# EAGLE schematic chip_counter (EAGLE 9.6.2)
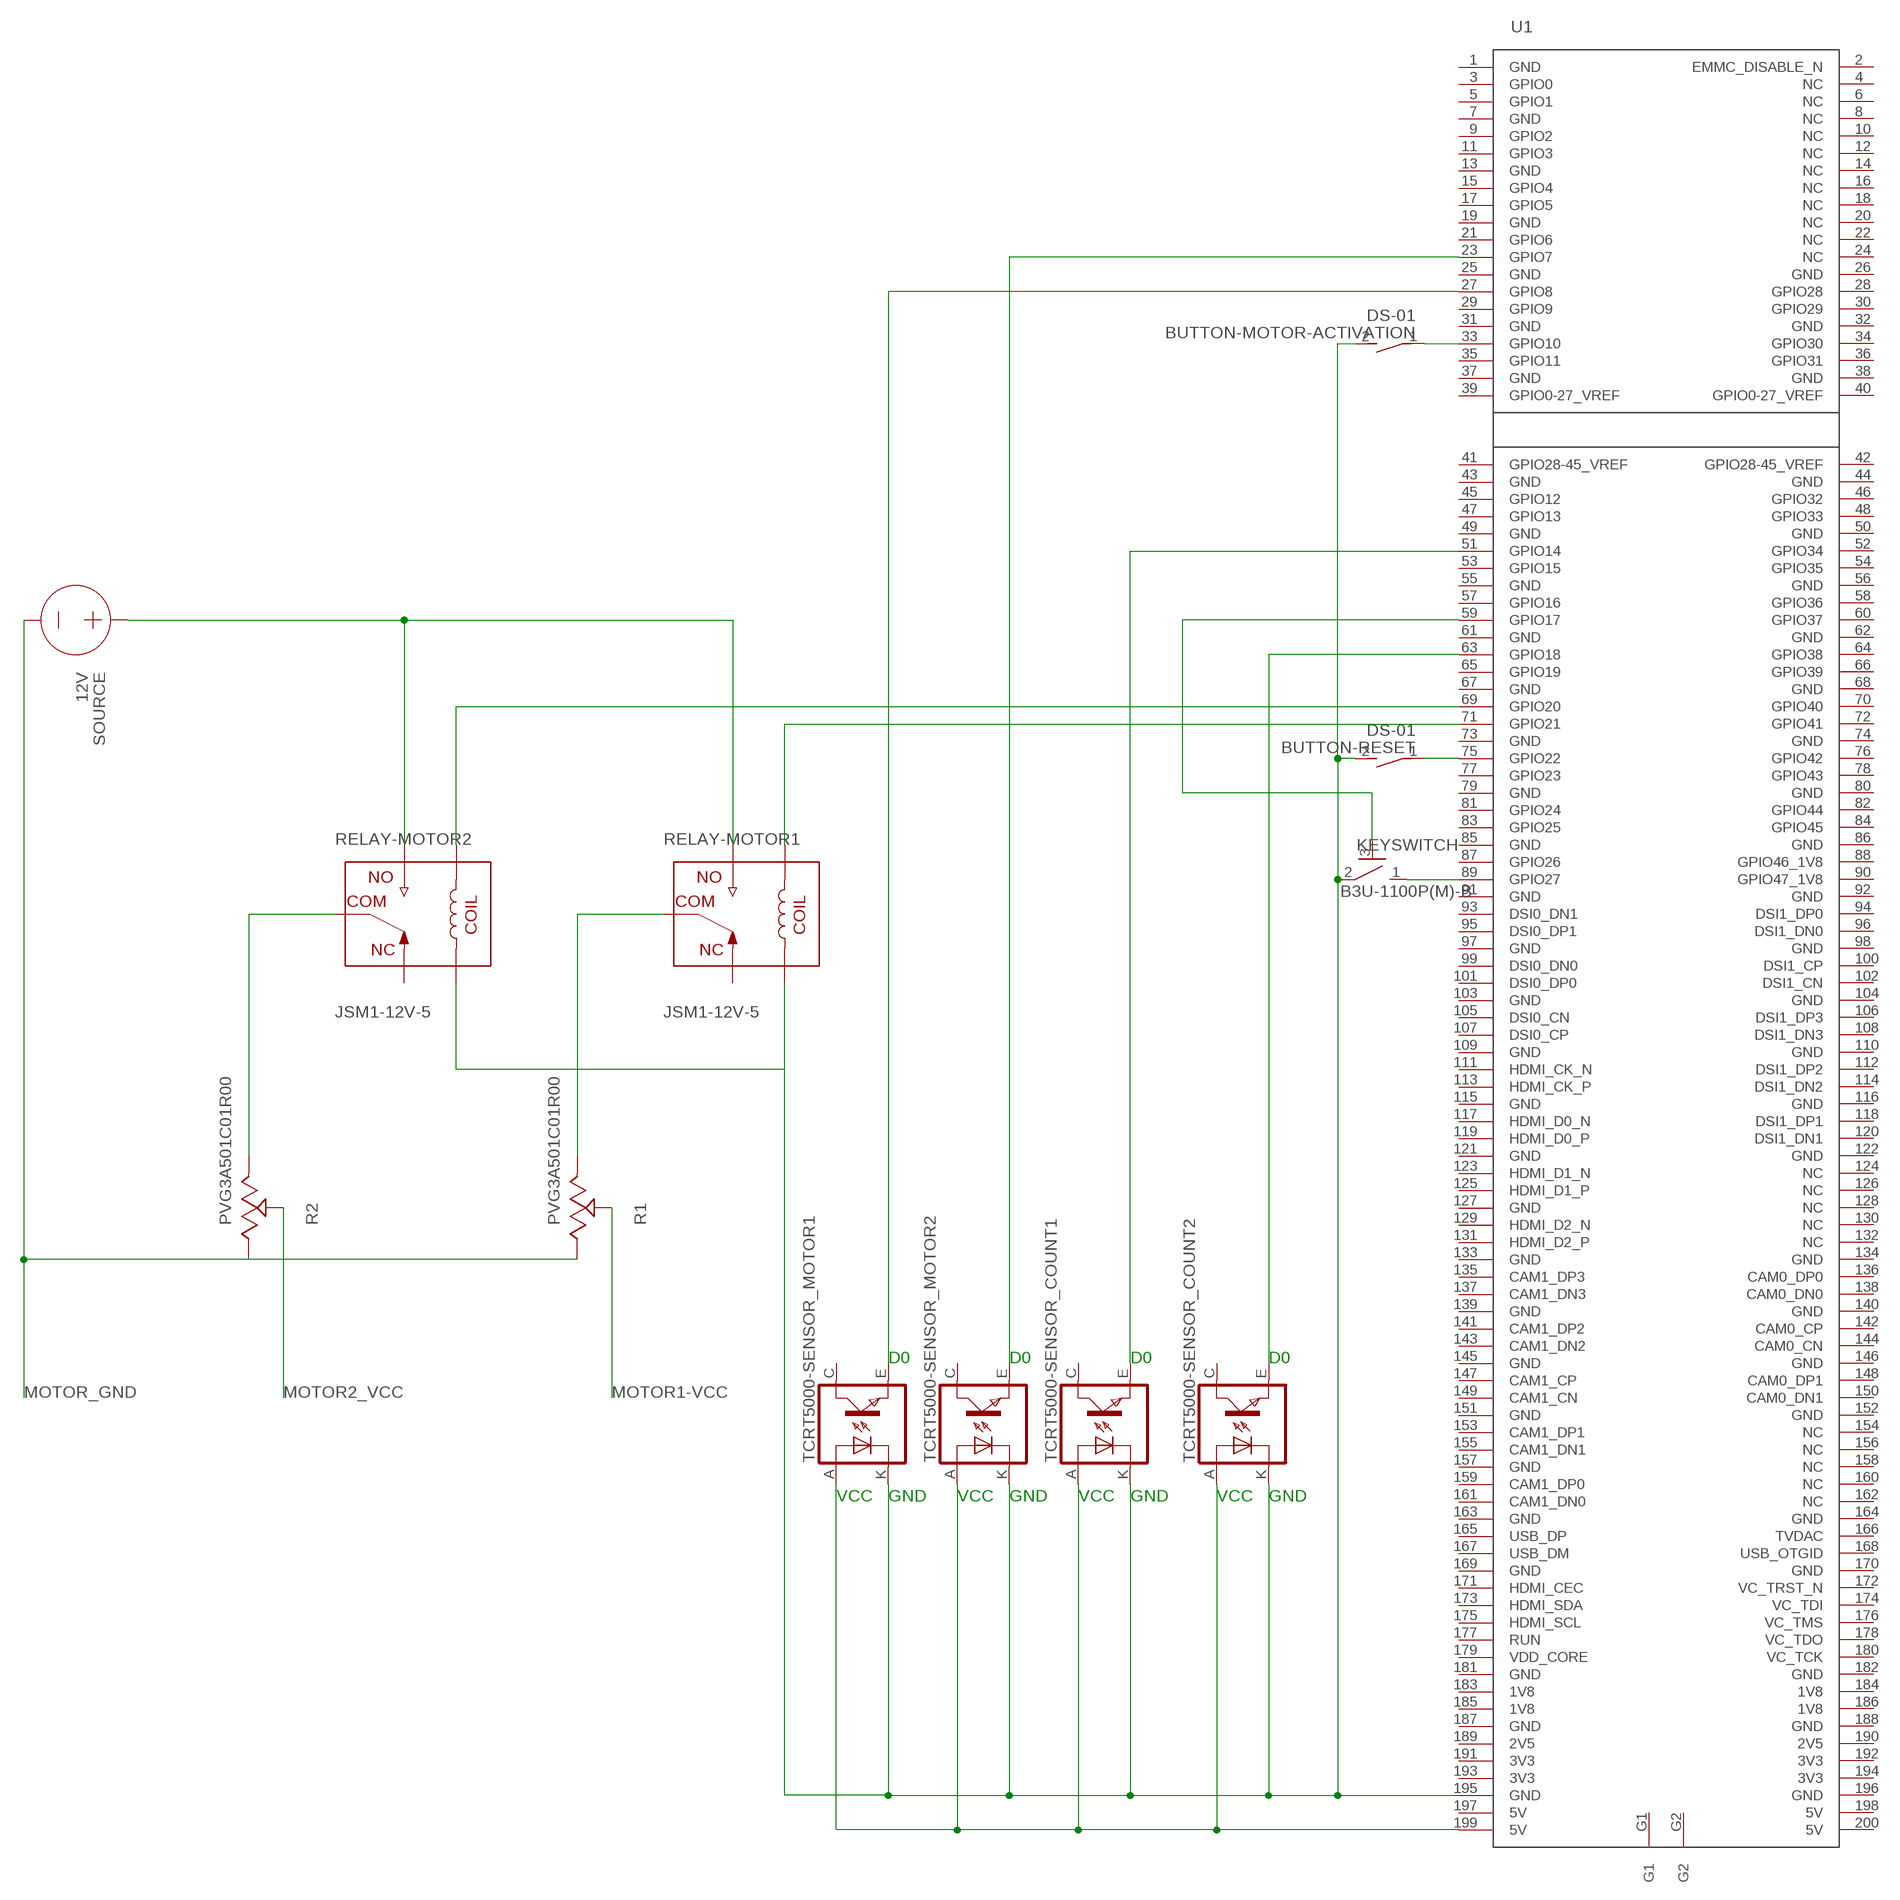
[diagram p0: schematic, sheet 1]

## Parts
BUTTON-MOTOR-ACTIVATION  DS-01  DS01E  [DS-01]
BUTTON-RESET  DS-01  DS01E  [DS-01]
KEYSWITCH  B3U-1100P(M)-B  B3U-X100B3U-1100P(M)-B1100P(M)-B  [B3U-1100P(M)-B]
R1  PVG3A501C01R00  [PVG3A501C01R00]
R2  PVG3A501C01R00  [PVG3A501C01R00]
RELAY-MOTOR1  JSM1-12V-5  [JSM1-12V-5]
RELAY-MOTOR2  JSM1-12V-5  [JSM1-12V-5]
SOURCE  12V  VOLTAGE  (no package)
TCRT5000-SENSOR_COUNT1  TCRT5000  [TCRT5000]
TCRT5000-SENSOR_COUNT2  TCRT5000  [TCRT5000]
TCRT5000-SENSOR_MOTOR1  TCRT5000  [TCRT5000]
TCRT5000-SENSOR_MOTOR2  TCRT5000  [TCRT5000]
U1  COMPUTE_MODULE  [SO-DIMM]

## Nets
MOTOR1-VCC: R1.2
MOTOR2_VCC: R2.2
MOTOR_GND: R1.3 R2.3 SOURCE.-
N$1: TCRT5000-SENSOR_COUNT1.A(ANODE) TCRT5000-SENSOR_COUNT2.A(ANODE) TCRT5000-SENSOR_MOTOR1.A(ANODE) TCRT5000-SENSOR_MOTOR2.A(ANODE) U1.199(5V)
N$3: TCRT5000-SENSOR_COUNT1.E(EMITTER) U1.51(GPIO14)
N$4: TCRT5000-SENSOR_COUNT2.E(EMITTER) U1.63(GPIO18)
N$5: TCRT5000-SENSOR_MOTOR1.E(EMITTER) U1.27(GPIO8)
N$6: TCRT5000-SENSOR_MOTOR2.E(EMITTER) U1.23(GPIO7)
N$7: BUTTON-MOTOR-ACTIVATION.2 BUTTON-RESET.2 KEYSWITCH.2 RELAY-MOTOR1.5 RELAY-MOTOR2.5 TCRT5000-SENSOR_COUNT1.K(CATHODE) TCRT5000-SENSOR_COUNT2.K(CATHODE) TCRT5000-SENSOR_MOTOR1.K(CATHODE) TCRT5000-SENSOR_MOTOR2.K(CATHODE) U1.195(GND)
N$8: BUTTON-RESET.1 U1.75(GPIO22)
N$9: BUTTON-MOTOR-ACTIVATION.1 U1.33(GPIO10)
N$10: KEYSWITCH.3 U1.59(GPIO17)
N$11: KEYSWITCH.1 U1.89(GPIO27)
N$12: RELAY-MOTOR1.2 U1.71(GPIO21)
N$13: RELAY-MOTOR2.2 U1.69(GPIO20)
N$16: RELAY-MOTOR1.3 RELAY-MOTOR2.3 SOURCE.+
N$18: R2.1 RELAY-MOTOR2.1
N$19: R1.1 RELAY-MOTOR1.1
Unconnected: RELAY-MOTOR1.4 RELAY-MOTOR2.4 TCRT5000-SENSOR_COUNT1.C(COLLECTOR) TCRT5000-SENSOR_COUNT2.C(COLLECTOR) TCRT5000-SENSOR_MOTOR1.C(COLLECTOR) TCRT5000-SENSOR_MOTOR2.C(COLLECTOR) U1.1(GND) U1.2(EMMC_DISABLE_N) U1.3(GPIO0) U1.4(NC) U1.5(GPIO1) U1.6(NC) U1.7(GND) U1.8(NC) U1.9(GPIO2) U1.10(NC) U1.11(GPIO3) U1.12(NC) U1.13(GND) U1.14(NC) U1.15(GPIO4) U1.16(NC) U1.17(GPIO5) U1.18(NC) U1.19(GND) U1.20(NC) U1.21(GPIO6) U1.22(NC) U1.24(NC) U1.25(GND) U1.26(GND) U1.28(GPIO28) U1.29(GPIO9) U1.30(GPIO29) U1.31(GND) U1.32(GND) U1.34(GPIO30) U1.35(GPIO11) U1.36(GPIO31) U1.37(GND) U1.38(GND) U1.39(GPIO0-27_VREF) U1.40(GPIO0-27_VREF) U1.41(GPIO28-45_VREF) U1.42(GPIO28-45_VREF) U1.43(GND) U1.44(GND) U1.45(GPIO12) U1.46(GPIO32) U1.47(GPIO13) U1.48(GPIO33) U1.49(GND) U1.50(GND) U1.52(GPIO34) U1.53(GPIO15) U1.54(GPIO35) U1.55(GND) U1.56(GND) U1.57(GPIO16) U1.58(GPIO36) U1.60(GPIO37) U1.61(GND) U1.62(GND) U1.64(GPIO38) U1.65(GPIO19) U1.66(GPIO39) U1.67(GND) U1.68(GND) U1.70(GPIO40) U1.72(GPIO41) U1.73(GND) U1.74(GND) U1.76(GPIO42) U1.77(GPIO23) U1.78(GPIO43) U1.79(GND) U1.80(GND) U1.81(GPIO24) U1.82(GPIO44) U1.83(GPIO25) U1.84(GPIO45) U1.85(GND) U1.86(GND) U1.87(GPIO26) U1.88(GPIO46_1V8) U1.90(GPIO47_1V8) U1.91(GND) U1.92(GND) U1.93(DSI0_DN1) U1.94(DSI1_DP0) U1.95(DSI0_DP1) U1.96(DSI1_DN0) U1.97(GND) U1.98(GND) U1.99(DSI0_DN0) U1.100(DSI1_CP) U1.101(DSI0_DP0) U1.102(DSI1_CN) U1.103(GND) U1.104(GND) U1.105(DSI0_CN) U1.106(DSI1_DP3) U1.107(DSI0_CP) U1.108(DSI1_DN3) U1.109(GND) U1.110(GND) U1.111(HDMI_CK_N) U1.112(DSI1_DP2) U1.113(HDMI_CK_P) U1.114(DSI1_DN2) U1.115(GND) U1.116(GND) U1.117(HDMI_D0_N) U1.118(DSI1_DP1) U1.119(HDMI_D0_P) U1.120(DSI1_DN1) U1.121(GND) U1.122(GND) U1.123(HDMI_D1_N) U1.124(NC) U1.125(HDMI_D1_P) U1.126(NC) U1.127(GND) U1.128(NC) U1.129(HDMI_D2_N) U1.130(NC) U1.131(HDMI_D2_P) U1.132(NC) U1.133(GND) U1.134(GND) U1.135(CAM1_DP3) U1.136(CAM0_DP0) U1.137(CAM1_DN3) U1.138(CAM0_DN0) U1.139(GND) U1.140(GND) U1.141(CAM1_DP2) U1.142(CAM0_CP) U1.143(CAM1_DN2) U1.144(CAM0_CN) U1.145(GND) U1.146(GND) U1.147(CAM1_CP) U1.148(CAM0_DP1) U1.149(CAM1_CN) U1.150(CAM0_DN1) U1.151(GND) U1.152(GND) U1.153(CAM1_DP1) U1.154(NC) U1.155(CAM1_DN1) U1.156(NC) U1.157(GND) U1.158(NC) U1.159(CAM1_DP0) U1.160(NC) U1.161(CAM1_DN0) U1.162(NC) U1.163(GND) U1.164(GND) U1.165(USB_DP) U1.166(TVDAC) U1.167(USB_DM) U1.168(USB_OTGID) U1.169(GND) U1.170(GND) U1.171(HDMI_CEC) U1.172(VC_TRST_N) U1.173(HDMI_SDA) U1.174(VC_TDI) U1.175(HDMI_SCL) U1.176(VC_TMS) U1.177(RUN) U1.178(VC_TDO) U1.179(VDD_CORE) U1.180(VC_TCK) U1.181(GND) U1.182(GND) U1.183(1V8) U1.184(1V8) U1.185(1V8) U1.186(1V8) U1.187(GND) U1.188(GND) U1.189(2V5) U1.190(2V5) U1.191(3V3) U1.192(3V3) U1.193(3V3) U1.194(3V3) U1.196(GND) U1.197(5V) U1.198(5V) U1.200(5V) U1.G1 U1.G2

## Notes on the sheet
- D0 | D0 | D0 | D0
- VCC | GND | VCC | GND | VCC | GND | VCC | GND

## Library data of the parts
BUTTON-MOTOR-ACTIVATION BUTTON-RESET = Switch:DS01E: DIL/CODE SWITCH; CATEGORY: SWITCH; TYPE: SPST
KEYSWITCH = Switch:B3U-X100: Ultra-small Tactile Switch Contact form : SPST-NO Datasheet <https://omronfs.omron.com/en_US/ecb/products/pdf/en-b3u.pdf>; CATEGORY: SWITCH; DESCRIPTION: Ultra-small Surface-mounting Tactile Switches with High Contact Reliability; MANUFACTURER: OMRON; OPERATING_TEMP: -25°C to +70°C at 60%RH max; PART_STATUS: ACTIVE; ROHS_COMPLIANCE: RoHS Compliant; SERIES: B3U; TYPE: Tactile
R1 R2 = Potentiometer_Trimmers:PVG3A501C01R00: TRIMMER 500 OHM 0.25W J LEAD TOP Manufacturer's datasheet <https://www.bourns.com/docs/Product-Datasheets/pvg3.pdf>; CREATED_BY: PCBLayout.com; DIGIKEY_PN: 490-2654-2-ND; MANUFACTURER: Bourns Inc.; MPN: PVG3A501C01R00
RELAY-MOTOR1 RELAY-MOTOR2 = Relay:JSM1-12V-5: RELAY AUTOMOTIVE SPDT 15A 12V Manufacturer's datasheet <https://media.digikey.com/pdf/Data%20Sheets/Panasonic%20Electric%20Works%20PDFs/JS-M_Series_Rev_Dec_2011.pdf>; CREATED_BY: PCBLayout.com; DIGIKEY_PARTNO: 255-1240-ND; MANUFACTURER: Panasonic Electric Works; MPN: JSM1-12V-5
SOURCE = ngspice-simulation:VOLTAGE: Independent Voltage Source, either DC, AC, PULSE, SINE, PWL, EXP, or SFFM; VALUE: 0V
TCRT5000-SENSOR_COUNT1 TCRT5000-SENSOR_COUNT2 TCRT5000-SENSOR_MOTOR1 TCRT5000-SENSOR_MOTOR2 = TCRT5000 (1):TCRT5000
U1 = Raspberry Pi CM:COMPUTE_MODULE: Raspberry Pi Compute Module www.hasseb.fi